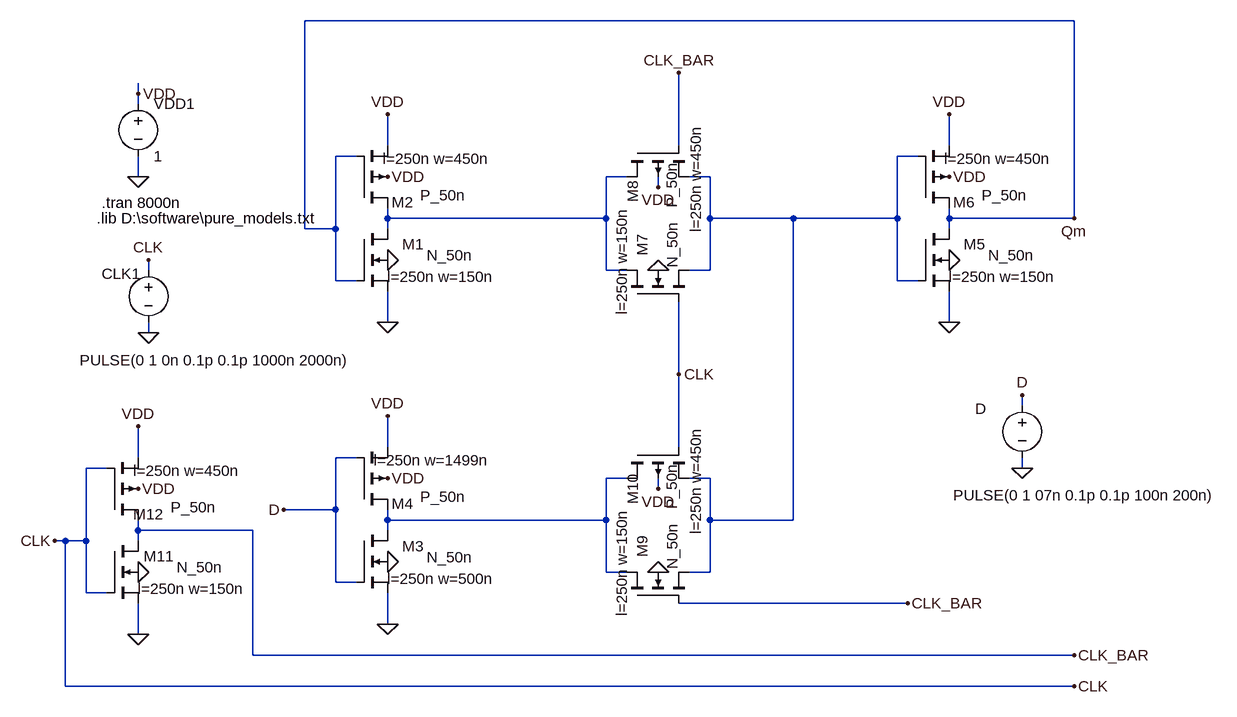
[diagram p0: schematic lab6(1).asc]
lab6(1).asc, the LTspice schematic file:
Version 4
SHEET 1 1128 684
WIRE 880 -400 -304 -400
WIRE -560 -288 -560 -304
WIRE -560 -272 -560 -288
WIRE -176 -208 -176 -256
WIRE 272 -208 272 -320
WIRE 688 -208 688 -256
WIRE -224 -192 -256 -192
WIRE 640 -192 608 -192
WIRE -560 -160 -560 -192
WIRE 192 -160 160 -160
WIRE 320 -160 288 -160
WIRE 240 -144 240 -160
WIRE -176 -96 -176 -112
WIRE 160 -96 160 -160
WIRE 160 -96 -176 -96
WIRE 320 -96 320 -160
WIRE 448 -96 320 -96
WIRE 608 -96 608 -192
WIRE 608 -96 448 -96
WIRE 688 -96 688 -112
WIRE 880 -96 880 -400
WIRE 880 -96 688 -96
WIRE -304 -80 -304 -400
WIRE -256 -80 -256 -192
WIRE -256 -80 -304 -80
WIRE -176 -80 -176 -96
WIRE 688 -80 688 -96
WIRE -544 -16 -544 -32
WIRE 160 -16 160 -96
WIRE 192 -16 160 -16
WIRE 320 -16 320 -96
WIRE 320 -16 288 -16
WIRE -256 0 -256 -80
WIRE -224 0 -256 0
WIRE 608 0 608 -96
WIRE 640 0 608 0
WIRE -176 64 -176 16
WIRE 688 64 688 16
WIRE -544 80 -544 64
WIRE 272 144 272 32
WIRE 800 192 800 176
WIRE -176 256 -176 208
WIRE 272 256 272 144
WIRE -560 272 -560 224
WIRE -224 272 -256 272
WIRE -608 288 -640 288
WIRE 800 288 800 272
WIRE 192 304 160 304
WIRE 320 304 288 304
WIRE 240 320 240 304
WIRE -256 352 -256 272
WIRE -256 352 -336 352
WIRE -176 368 -176 352
WIRE 160 368 160 304
WIRE 160 368 -176 368
WIRE 320 368 320 304
WIRE 448 368 448 -96
WIRE 448 368 320 368
WIRE -560 384 -560 368
WIRE -384 384 -560 384
WIRE -176 384 -176 368
WIRE -672 400 -688 400
WIRE -640 400 -640 288
WIRE -640 400 -672 400
WIRE -560 400 -560 384
WIRE 160 448 160 368
WIRE 192 448 160 448
WIRE 320 448 320 368
WIRE 320 448 288 448
WIRE -256 464 -256 352
WIRE -224 464 -256 464
WIRE -640 480 -640 400
WIRE -608 480 -640 480
WIRE 624 496 272 496
WIRE -176 528 -176 480
WIRE -560 544 -560 496
WIRE -384 576 -384 384
WIRE 880 576 -384 576
WIRE -672 624 -672 400
WIRE 880 624 -672 624
FLAG -544 80 0
FLAG -544 -32 CLK
FLAG -560 -160 0
FLAG -560 -288 VDD
FLAG -176 -32 0
FLAG -176 -160 VDD
FLAG -176 64 0
FLAG -176 -256 VDD
FLAG -176 432 0
FLAG -176 304 VDD
FLAG -176 528 0
FLAG -176 208 VDD
FLAG 688 -32 0
FLAG 688 -160 VDD
FLAG 688 64 0
FLAG 688 -256 VDD
FLAG 240 -16 0
FLAG 240 -144 VDD
FLAG 240 448 0
FLAG 240 320 VDD
FLAG -560 448 0
FLAG -560 320 VDD
FLAG -560 544 0
FLAG -560 224 VDD
FLAG -688 400 CLK
FLAG 880 624 CLK
FLAG 880 576 CLK_BAR
FLAG 272 -320 CLK_BAR
FLAG 272 144 CLK
FLAG -336 352 D
FLAG 880 -96 Qm
FLAG 624 496 CLK_BAR
FLAG 800 288 0
FLAG 800 176 D
SYMBOL voltage -544 -32 R0
WINDOW 0 -72 21 Left 2
WINDOW 3 -106 154 Left 2
WINDOW 123 0 0 Left 2
WINDOW 39 0 0 Left 2
SYMATTR InstName CLK1
SYMATTR Value PULSE(0 1 0n 0.1p 0.1p 1000n 2000n)
SYMBOL voltage -560 -288 R0
WINDOW 123 0 0 Left 2
WINDOW 39 0 0 Left 2
SYMATTR InstName VDD1
SYMATTR Value 1
SYMBOL nmos4 -224 -80 R0
WINDOW 0 104 24 Right 2
WINDOW 3 179 41 Right 2
WINDOW 123 213 74 Right 2
SYMATTR InstName M1
SYMATTR Value N_50n
SYMATTR Value2 l=250n w=150n
SYMBOL pmos4 -224 -112 M180
WINDOW 0 88 9 Right 2
WINDOW 3 168 20 Right 2
WINDOW 123 206 76 Right 2
SYMATTR InstName M2
SYMATTR Value P_50n
SYMATTR Value2 l=250n w=450n
SYMBOL nmos4 -224 384 R0
WINDOW 0 104 24 Right 2
WINDOW 3 179 41 Right 2
WINDOW 123 213 74 Right 2
SYMATTR InstName M3
SYMATTR Value N_50n
SYMATTR Value2 l=250n w=500n
SYMBOL pmos4 -224 352 M180
WINDOW 0 88 9 Right 2
WINDOW 3 168 20 Right 2
WINDOW 123 206 76 Right 2
SYMATTR InstName M4
SYMATTR Value P_50n
SYMATTR Value2 l=250n w=1499n
SYMBOL nmos4 640 -80 R0
WINDOW 0 104 24 Right 2
WINDOW 3 179 41 Right 2
WINDOW 123 213 74 Right 2
SYMATTR InstName M5
SYMATTR Value N_50n
SYMATTR Value2 l=250n w=150n
SYMBOL pmos4 640 -112 M180
WINDOW 0 88 9 Right 2
WINDOW 3 168 20 Right 2
WINDOW 123 206 76 Right 2
SYMATTR InstName M6
SYMATTR Value P_50n
SYMATTR Value2 l=250n w=450n
SYMBOL nmos4 192 32 R270
WINDOW 0 104 24 Right 2
WINDOW 3 123 70 Right 2
WINDOW 123 145 -8 Right 2
SYMATTR InstName M7
SYMATTR Value N_50n
SYMATTR Value2 l=250n w=150n
SYMBOL pmos4 192 -208 M90
WINDOW 0 88 9 Right 2
WINDOW 3 96 69 Right 2
WINDOW 123 134 106 Right 2
SYMATTR InstName M8
SYMATTR Value P_50n
SYMATTR Value2 l=250n w=450n
SYMBOL nmos4 192 496 R270
WINDOW 0 104 24 Right 2
WINDOW 3 123 70 Right 2
WINDOW 123 145 -8 Right 2
SYMATTR InstName M9
SYMATTR Value N_50n
SYMATTR Value2 l=250n w=150n
SYMBOL pmos4 192 256 M90
WINDOW 0 88 9 Right 2
WINDOW 3 96 69 Right 2
WINDOW 123 134 106 Right 2
SYMATTR InstName M10
SYMATTR Value P_50n
SYMATTR Value2 l=250n w=450n
SYMBOL nmos4 -608 400 R0
WINDOW 0 104 24 Right 2
WINDOW 3 179 41 Right 2
WINDOW 123 213 74 Right 2
SYMATTR InstName M11
SYMATTR Value N_50n
SYMATTR Value2 l=250n w=150n
SYMBOL pmos4 -608 368 M180
WINDOW 0 88 9 Right 2
WINDOW 3 168 20 Right 2
WINDOW 123 206 76 Right 2
SYMATTR InstName M12
SYMATTR Value P_50n
SYMATTR Value2 l=250n w=450n
SYMBOL voltage 800 176 R0
WINDOW 0 -72 21 Left 2
WINDOW 3 -106 154 Left 2
WINDOW 123 0 0 Left 2
WINDOW 39 0 0 Left 2
SYMATTR InstName D
SYMATTR Value PULSE(0 1 07n 0.1p 0.1p 100n 200n)
TEXT -616 -120 Left 2 !.tran 8000n
TEXT -624 -96 Left 2 !.lib D:\\software\\pure_models.txt

The netlist it stands for:
* lab6(1).asc
V§CLK1 CLK 0 PULSE(0 1 0n 0.1p 0.1p 1000n 2000n)
VDD1 VDD 0 1
M1 N002 Qm 0 0 N_50n l=250n w=150n
M2 N002 Qm VDD VDD P_50n l=250n w=450n
M3 N003 D 0 0 N_50n l=250n w=500n
M4 N003 D VDD VDD P_50n l=250n w=1499n
M5 Qm N001 0 0 N_50n l=250n w=150n
M6 Qm N001 VDD VDD P_50n l=250n w=450n
M7 N002 CLK N001 0 N_50n l=250n w=150n
M8 N002 CLK_BAR N001 VDD P_50n l=250n w=450n
M9 N003 CLK_BAR N001 0 N_50n l=250n w=150n
M10 N003 CLK N001 VDD P_50n l=250n w=450n
M11 CLK_BAR CLK 0 0 N_50n l=250n w=150n
M12 CLK_BAR CLK VDD VDD P_50n l=250n w=450n
V§D D 0 PULSE(0 1 07n 0.1p 0.1p 100n 200n)
.model NMOS NMOS
.model PMOS PMOS
.lib standard.mos
.tran 8000n
.lib D:\software\pure_models.txt
.backanno
.end